# EAGLE schematic power_board (EAGLE 9.5.1)
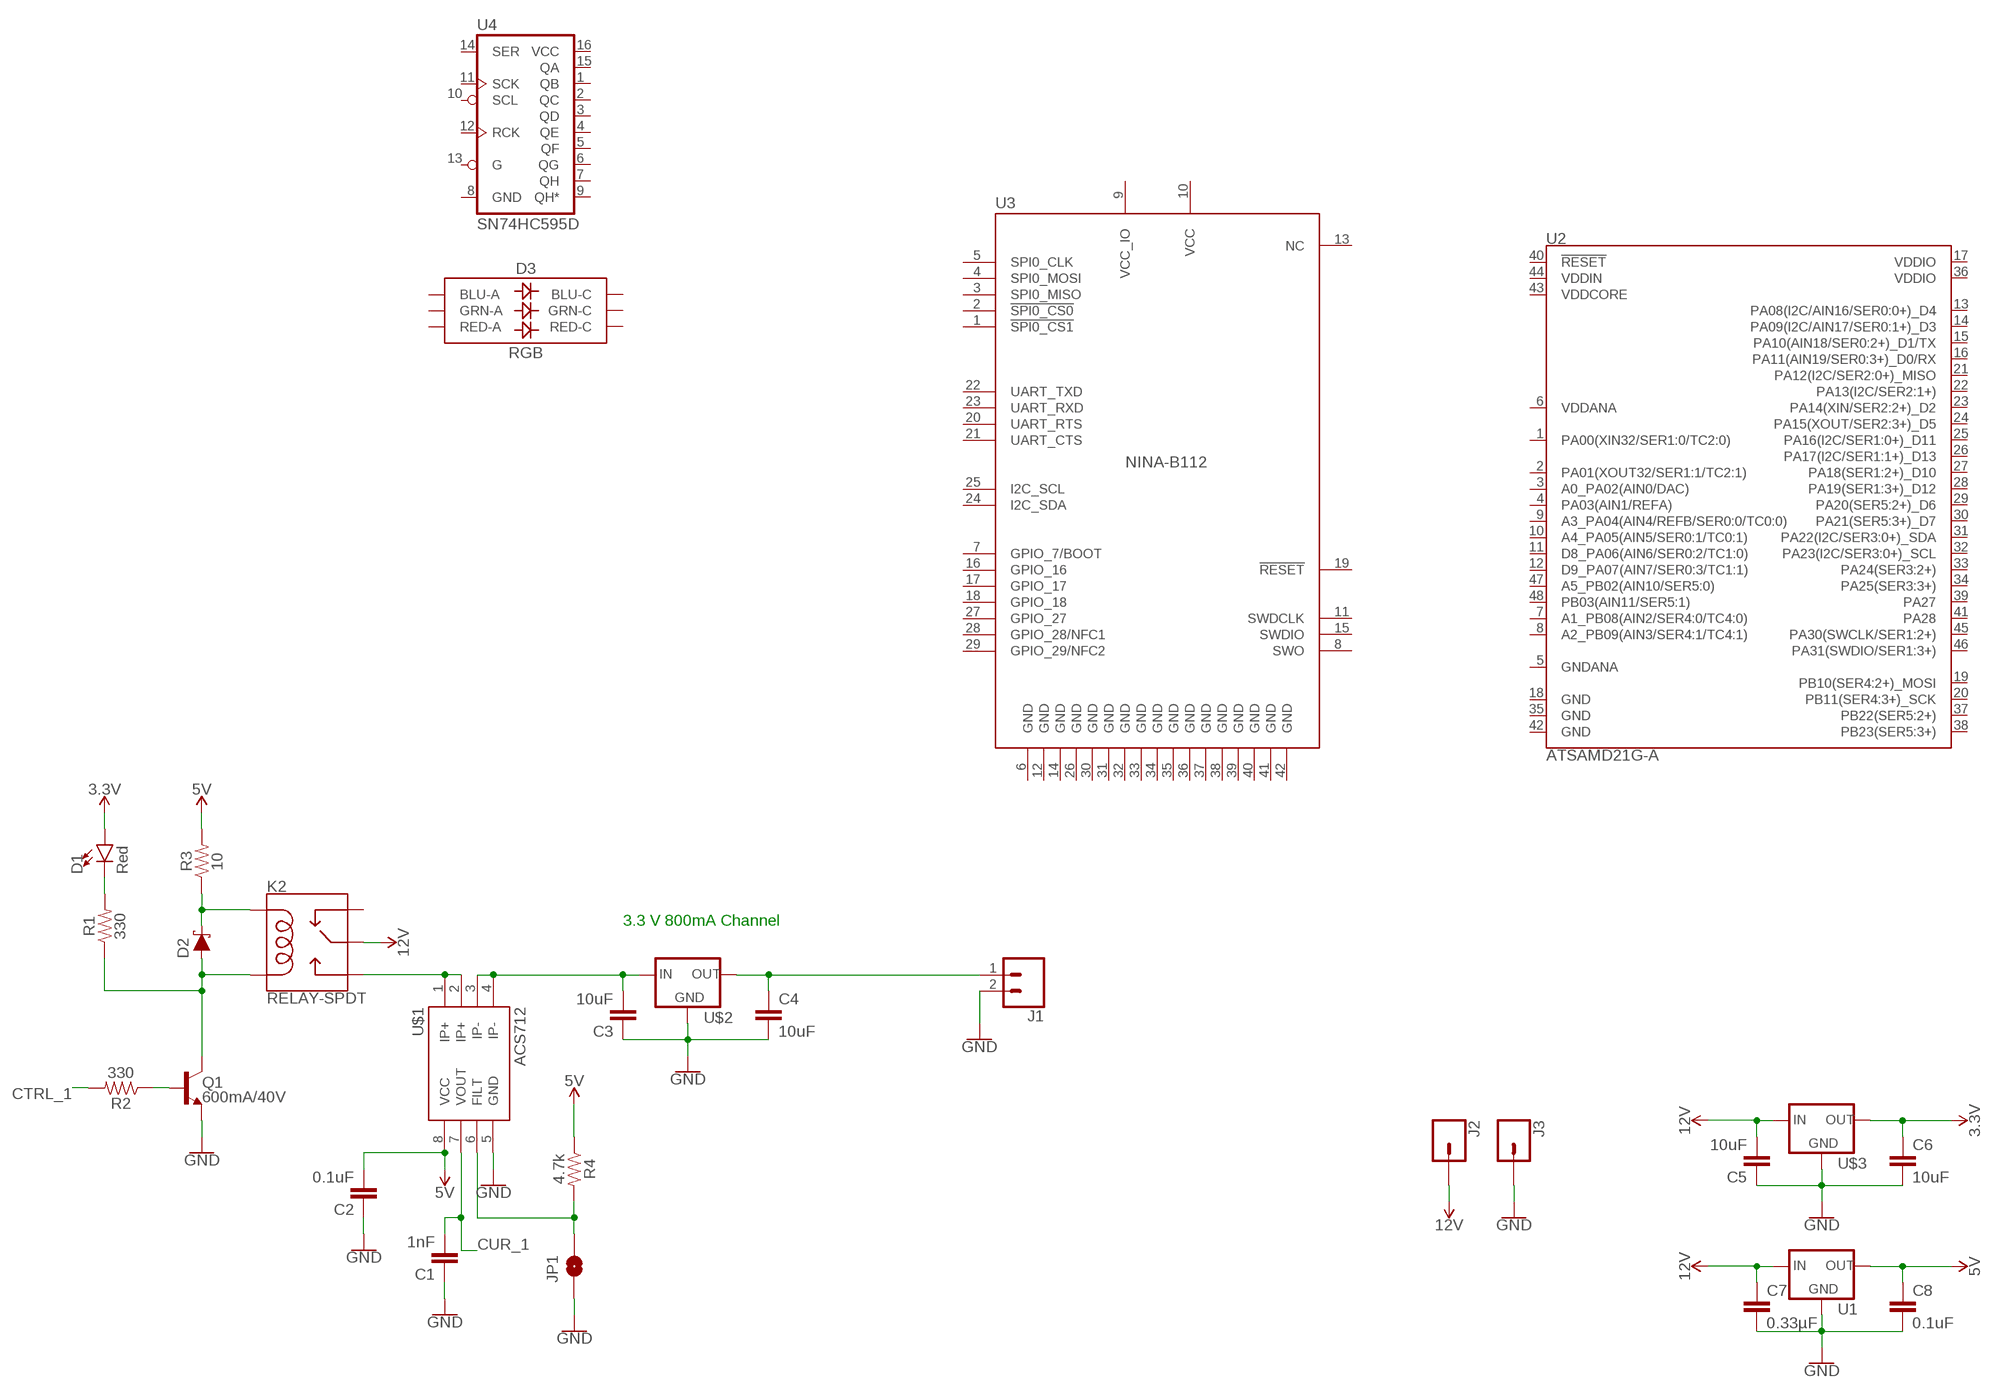
[diagram p0: schematic, sheet 1]

## Parts
C1  1nF  1.0NF/1000PF-0603-50V-10%  [0603]
C2  0.1uF  0.1UF-0603-25V-(+80/-20%)  [0603]
C3  10uF  10UF-0603-6.3V-20%  [0603]
C4  10uF  10UF-0603-6.3V-20%  [0603]
C5  10uF  10UF-0603-6.3V-20%  [0603]
C6  10uF  10UF-0603-6.3V-20%  [0603]
C7  0.33µF  0.33UF/330NF-0805-50V-10%  [0805]
C8  0.1uF  0.1UF-0603-25V-(+80/-20%)  [0603]
D1  Red  LED-RED0603-SMART  [LED-0603]
D2  1A/23V/620mV  DIODE-SCHOTTKY-BAT20J  [SOD-323]
D3  RGB  LED-RGBPLCC-6  [PLCC-6-LED]
J1  CONN_023.5MM  [SCREWTERMINAL-3.5MM-2]
J2  CONN_01PTH_2MM  [1X01_2MM]
J3  CONN_01PTH_2MM  [1X01_2MM]
JP1  JUMPER-SMT_2_NO_NO-SILK_ROUND  [SMT-JUMPER_2_NO_NO-SILK_ROUND]
K2  RELAY-SPDT  [RELAY_G5LE]
Q1  600mA/40V  TRANS_NPN-MMBT2222AL  [SOT23-3]
R1  330  330OHM-0603-1/10W-1%  [0603]
R2  330  330OHM-0603-1/10W-1%  [0603]
R3  10  10OHM-0603-1/10W-1%  [0603]
R4  4.7k  4.7KOHM-0603-1/10W-1%  [0603]
U1  V_REG_78XX-TO-220  [TO-220-ALT]
U2  ATSAMD21G-A  [TQFP-48]
U3  NINA-B112  [NINA112-42]
U4  SN74HC595D  74HC595D  [SO16]
U$1  ACS712  [SO08]
U$2  3.3V Voltage Regulator  V_REG_LD1117VXXLD1117-SMD  [SOT223]
U$3  3.3V Voltage Regulator  V_REG_LD1117VXXLD1117-SMD  [SOT223]

## Nets
3.3V: C6.1 D1.A U$3.2(OUT)
5V: C2.2 C8.1 R3.2 R4.1 U1.OUT U$1.8(VCC)
12V: C5.2 C7.1 J2.1 K2.1(MAIN) U1.IN U$3.3(IN)
CTRL_1: R2.2
CUR_1: C1.2 U$1.7(VOUT)
GND: C1.1 C2.1 C3.1 C4.2 C5.1 C6.2 C7.2 C8.2 J1.2 J3.1 JP1.1 Q1.2(E) U1.GND U$1.5(GND) U$2.1(GND) U$3.1(GND)
N$1: K2.3(NO) U$1.1(IP+) U$1.2(IP+)
N$2: C3.2 U$1.3(IP-) U$1.4(IP-) U$2.3(IN)
N$3: C4.1 J1.1 U$2.2(OUT)
N$4: D2.A K2.5(COIL2) Q1.3(C) R1.1
N$5: D2.C K2.2(COIL1) R3.1
N$6: D1.C R1.2
N$7: JP1.2 R4.2 U$1.6(FILT)
N$9: Q1.1(B) R2.1
Unconnected: D3.AB(BLU-A) D3.AG(GRN-A) D3.AR(RED-A) D3.CB(BLU-C) D3.CG(GRN-C) D3.CR(RED-C) K2.4(NC) U2.1(PA00(XIN32/SER1:0/TC2:0)) U2.2(PA01(XOUT32/SER1:1/TC2:1)) U2.3(A0_PA02(AIN0/DAC)) U2.4(PA03(AIN1/REFA)) U2.5(GNDANA) U2.6(VDDANA) U2.7(A1_PB08(AIN2/SER4:0/TC4:0)) U2.8(A2_PB09(AIN3/SER4:1/TC4:1)) U2.9(A3_PA04(AIN4/REFB/SER0:0/TC0:0)) U2.10(A4_PA05(AIN5/SER0:1/TC0:1)) U2.11(D8_PA06(AIN6/SER0:2/TC1:0)) U2.12(D9_PA07(AIN7/SER0:3/TC1:1)) U2.13(PA08(I2C/AIN16/SER0:0+)_D4) U2.14(PA09(I2C/AIN17/SER0:1+)_D3) U2.15(PA10(AIN18/SER0:2+)_D1/TX) U2.16(PA11(AIN19/SER0:3+)_D0/RX) U2.17(VDDIO) U2.18(GND) U2.19(PB10(SER4:2+)_MOSI) U2.20(PB11(SER4:3+)_SCK) U2.21(PA12(I2C/SER2:0+)_MISO) U2.22(PA13(I2C/SER2:1+)) U2.23(PA14(XIN/SER2:2+)_D2) U2.24(PA15(XOUT/SER2:3+)_D5) U2.25(PA16(I2C/SER1:0+)_D11) U2.26(PA17(I2C/SER1:1+)_D13) U2.27(PA18(SER1:2+)_D10) U2.28(PA19(SER1:3+)_D12) U2.29(PA20(SER5:2+)_D6) U2.30(PA21(SER5:3+)_D7) U2.31(PA22(I2C/SER3:0+)_SDA) U2.32(PA23(I2C/SER3:0+)_SCL) U2.33(PA24(SER3:2+)) U2.34(PA25(SER3:3+)) U2.35(GND) U2.36(VDDIO) U2.37(PB22(SER5:2+)) U2.38(PB23(SER5:3+)) U2.39(PA27) U2.40(!RESET!) U2.41(PA28) U2.42(GND) U2.43(VDDCORE) U2.44(VDDIN) U2.45(PA30(SWCLK/SER1:2+)) U2.46(PA31(SWDIO/SER1:3+)) U2.47(A5_PB02(AIN10/SER5:0)) U2.48(PB03(AIN11/SER5:1)) U3.1(!SPI0_CS1!) U3.2(!SPI0_CS0) U3.3(SPI0_MISO) U3.4(SPI0_MOSI) U3.5(SPI0_CLK) U3.7(GPIO_7/BOOT) U3.8(SWO) U3.11(SWDCLK) U3.13(NC) U3.15(SWDIO) U3.16(GPIO_16) U3.17(GPIO_17) U3.18(GPIO_18) U3.19(!RESET) U3.20(UART_RTS) U3.21(UART_CTS) U3.22(UART_TXD) U3.23(UART_RXD) U3.24(I2C_SDA) U3.25(I2C_SCL) U3.27(GPIO_27) U3.28(GPIO_28/NFC1) U3.29(GPIO_29/NFC2) U4.1(QB) U4.2(QC) U4.3(QD) U4.4(QE) U4.5(QF) U4.6(QG) U4.7(QH) U4.9(QH*) U4.10(SCL) U4.11(SCK) U4.12(RCK) U4.13(G) U4.14(SER) U4.15(QA)

## Notes on the sheet
- 3.3 V 800mA Channel

## Power pins joined to a net without a drawn wire
GND: U3.6(GND) U3.12(GND) U3.14(GND) U3.26(GND) U3.30(GND) U3.31(GND) U3.32(GND) U3.33(GND) U3.34(GND) U3.35(GND) U3.36(GND) U3.37(GND) U3.38(GND) U3.39(GND) U3.40(GND) U3.41(GND) U3.42(GND) U4.8(GND)
VCC: U3.10(VCC) U4.16(VCC)
VCC_IO: U3.9(VCC_IO)

## Library data of the parts
C1 = SparkFun-Capacitors:1.0NF/1000PF: 1nF/1,000pF ceramic capacitors A capacitor is a passive two-terminal electrical component used to store electrical energy temporarily in an electric field.; PROD_ID: CAP-07886
C2 C8 = SparkFun-Capacitors:0.1UF: 0.1µF ceramic capacitors A capacitor is a passive two-terminal electrical component used to store electrical energy temporarily in an electric field.; PROD_ID: CAP-00810
C3-C6 = SparkFun-Capacitors:10UF: 10.0µF ceramic capacitors A capacitor is a passive two-terminal electrical component used to store electrical energy temporarily in an electric field.; PROD_ID: CAP-11015
C7 = SparkFun-Capacitors:0.33UF/330NF: 0.33µF/330nF ceramic capacitors A capacitor is a passive two-terminal electrical component used to store electrical energy temporarily in an electric field.; PROD_ID: CAP-08469
D1 = SparkFun-LED:LED-RED: Red SMD LED Used in manufacturing of most products at SparkFun Packages: 0603 - SMD 0603 package [Product Link] <http://docs.avagotech.com/docs/AV02-0551EN> 0603 SMART - SMD 0603 SMART package ( more efficient and expensive)[Product Link] <http://www.osram-os.com/Graphics/XPic2/00077099_0.pdf> 1206 - SMD1206 package [Product Link] <https://www.sparkfun.com/datasheets/DevTools/LilyPad/Q150OVS4.pdff> SparkFun Products: Pro Mini 328 -5V <https://www.sparkfun.com/products/821> RedBoard <https://www.sparkfun.com/products/12757> IOIO-OTG <https://www.sparkfun.com/products/13613>; PROD_ID: DIO-11154
D2 = SparkFun-DiscreteSemi:DIODE-SCHOTTKY: Schottky diode A Schottky diode is a semiconductor diode which has a low forward voltage drop and a very fast switching action.; PROD_ID: DIO-11623
D3 = SparkFun-LED:LED-RGB: LED-RGB 6 pin RGB LED (no common connector) Packages: PLCC-6 LED-TRICOLOR-5050 - No built-in IC SparkFun Products: Digital Sandbox <https://www.sparkfun.com/products/12651> LED- SMD RGB <https://www.sparkfun.com/products/10866>; PROD_ID: DIO-12113
J1 = SparkFun-Connectors:CONN_02: Multi connection point. Often used as Generic Header-pin footprint for 0.1 inch spaced/style header connections On any of the 0.1 inch spaced packages, you can populate with these: Break Away Headers - Straight <https://www.sparkfun.com/products/116> (PRT-00116) Break Away Male Headers - Right Angle <https://www.sparkfun.com/products/553> (PRT-00553) Female Headers <https://www.sparkfun.com/products/115> (PRT-00115) Break Away Headers - Machine Pin <https://www.sparkfun.com/products/117> (PRT-00117) Break Away Female Headers - Swiss Machine Pin <https://www.sparkfun.com/products/743> (PRT-00743) For SCREWTERMINALS and SPRING TERMINALS visit here: Screw Terimnals on SparkFun.com <https://www.sparkfun.com/search/results?term=Screw+Terminals> (5mm/3.5mm/2.54mm spacing) This device is also useful as a general connection point to wire up your design to another part of your project. Our various solder wires solder well into these plated through hole pads. Hook-Up Wire - Assortment (Stranded, 22 AWG) <https://www.sparkfun.com/products/11375> (PRT-11375) Hook-Up Wire - Assortment (Solid Core, 22 AWG) <https://www.sparkfun.com/products/11367> (PRT-11367) View the entire wire category on our website here <https://www.sparkfun.com/categories/141> Special notes: Molex polarized connector foot print use with: PRT-08233 with associated crimp pins and housings. 2.54_SCREWTERM for use with PRT-10571. 3.5mm Screw Terminal footprints for PRT-08084 5mm Screw Terminal footprints for use with PRT-08432; PROD_ID: CONN-08399
J2 J3 = SparkFun-Connectors:CONN_01: Single connection point. Often used as Generic Header-pin footprint for 0.1 inch spaced/style header connections On any of the 0.1 inch spaced packages, you can populate with these: Break Away Headers - Straight <https://www.sparkfun.com/products/116> (PRT-00116) Break Away Male Headers - Right Angle <https://www.sparkfun.com/products/553> (PRT-00553) Female Headers <https://www.sparkfun.com/products/115> (PRT-00115) Break Away Headers - Machine Pin <https://www.sparkfun.com/products/117> (PRT-00117) Break Away Female Headers - Swiss Machine Pin <https://www.sparkfun.com/products/743> (PRT-00743) This device is also useful as a general connection point to wire up your design to another part of your project. Our various solder wires solder well into these plated through hole pads. Hook-Up Wire - Assortment (Stranded, 22 AWG) <https://www.sparkfun.com/products/11375> (PRT-11375) Hook-Up Wire - Assortment (Solid Core, 22 AWG) <https://www.sparkfun.com/products/11367> (PRT-11367) View the entire wire category on our website here <https://www.sparkfun.com/categories/141> Special notes: SMTSO-256-ET is a "flush mount" nut for a 4-40 screw. We mostly use this on specialty testbeds; it is a nice way to connect hardware to your PCB at an adjustable hieght. Also note, the SNAP packages are for using a snappable style connector. We sell a baggie of snaps and they are also used on two LilyPad designs: Snap Assortment - 30 pack (male and female) <https://www.sparkfun.com/products/11347> (DEV-11347) LilyPad Arduino SimpleSnap <https://www.sparkfun.com/products/10941> (DEV-10941) LilyPad SimpleSnap Protoboard <https://www.sparkfun.com/products/10940> (DEV-10940)
JP1 = SparkFun-Jumpers:JUMPER-SMT_2_NO: Normally open jumper This jumper has two pads in close proximity to each other. Apply solder to close the connection. Round pads are easier to solder for beginners, but are a lot larger. SparkFun Product that uses the round pads: SparkFun EL Sequencer <https://www.sparkfun.com/products/12781>
K2 = SparkFun-Electromechanical:RELAY-SPDT: SPDT Electromechanical Relay Single-pole, double-throw sealed relays. When current is applied to the coil, it throws a simple changeover switch, terminating the connection from the NC contact to ground and closing the NO contact. Use them to switch high voltage/high current devices. SparkFun Products JQX-15F: Relay SPDT Sealed - 20A <https://www.sparkfun.com/products/10924> (COM-10924) JZC-11F: Relay SPDT Sealed <https://www.sparkfun.com/products/100> (COM-00100); PROD_ID: COMP-14214
Q1 = SparkFun-DiscreteSemi:TRANS_NPN: NPN transistor Current controlled devices typically used to amplify current or used as a switch. BC547 - COM-08928 <http://www.sparkfun.com/products/8928> (TO-92 45V 100mA) (1.Collector 2.Base 3.Emitter) 2N3904 - COM-00521 <http://www.sparkfun.com/products/521> (TO-92 40V 200mA) (1.Emitter 2.Base 3.Collector) P2N2222A - COM-12852 <http://www.sparkfun.com/products/12852> (TO-92 40V 600mA) (1.Collector 2.Base 3.Emitter); PROD_ID: TRANS-08049
R1 R2 = SparkFun-Resistors:330OHM: 330Ω resistor A resistor is a passive two-terminal electrical component that implements electrical resistance as a circuit element. Resistors act to reduce current flow, and, at the same time, act to lower voltage levels within circuits. - Wikipedia; PROD_ID: RES-00818
R3 = SparkFun-Resistors:10OHM: 10Ω resistor A resistor is a passive two-terminal electrical component that implements electrical resistance as a circuit element. Resistors act to reduce current flow, and, at the same time, act to lower voltage levels within circuits. - Wikipedia; PROD_ID: RES-12581
R4 = SparkFun-Resistors:4.7KOHM: 4.7kΩ resistor A resistor is a passive two-terminal electrical component that implements electrical resistance as a circuit element. Resistors act to reduce current flow, and, at the same time, act to lower voltage levels within circuits. - Wikipedia; PROD_ID: RES-07857
U1 = SparkFun-IC-Power:V_REG_78XX: Voltage Regulator Standard 78xx regulator. IGO (Input Ground Output). Spark Fun Electronics SKU : COM-00107; PROD_ID: VREG-08450; SF_ID: COM-00107
U2 = SparkFun-IC-Microcontroller:ATSAMD21G: Atmel SAMD21G SMART ARM-Based Microcontroller The Atmel ® | SMART ™ SAM D21 is a series of low-power microcontrollers using the 32-bit ARM ® Cortex ® -M0+ processor, and ranging from 32- to 64-pins with up to 256KB Flash and 32KB of SRAM. The SAM D21 devices operate at a maximum frequency of 48MHz and reach 2.46 CoreMark/MHz. They are designed for simple and intuitive migration with identical peripheral modules, hex compatible code, identical linear address map and pin compatible migration paths between all devices in the product series. All devices include intelligent and flexible peripherals, Atmel Event System for inter-peripheral signaling, and support for capacitive touch button, slider and wheel user interfaces. Datasheet <https://cdn.sparkfun.com/datasheets/Dev/Arduino/Boards/Atmel-42181-SAM-D21_Datasheet.pdf> SparkFun Products SparkFun SAMD21 Mini Breakout <https://www.sparkfun.com/products/13664> (DEV-13664) SparkFun SAMD21 Dev Breakout <https://www.sparkfun.com/products/13672> (DEV-13672) (DEV-14926); PROD_ID: IC-13064
U3 = ubloxLib:NINA-B112: NINA-B112: BLE stand-alone module u-blox.com
U4 = SparkFun-IC-Logic:74*595: 8-Bit Shift Register (Serial to Parallel) Datasheet <http://cdn.sparkfun.com/datasheets/BreakoutBoards/MM74HC595.pdf> SparkFun Products SparkFun Shift Register Breakout - 74HC595 <https://www.sparkfun.com/products/10680> (BOB-10680); PROD_ID: IC-07875
U$1 = SparkFun-Sensors:ACS712: ACS712 Hall-effect-based isolated linear current sensor Datasheet <http://www.sparkfun.com/datasheets/BreakoutBoards/0712.pdf> SparkFun Products SparkFun Low Current Sensor Breakout - ACS712 <https://www.sparkfun.com/products/8883> (SEN-08883); PROD_ID: IC-08964
U$2 U$3 = SparkFun-IC-Power:V_REG_LD1117VXX: LD1117VXX voltage regulator. We carry the 3.3V version (COM-00526) in TO-220 package.; PROD_ID: VREG-13917